# EAGLE schematic miner (EAGLE 6.4)
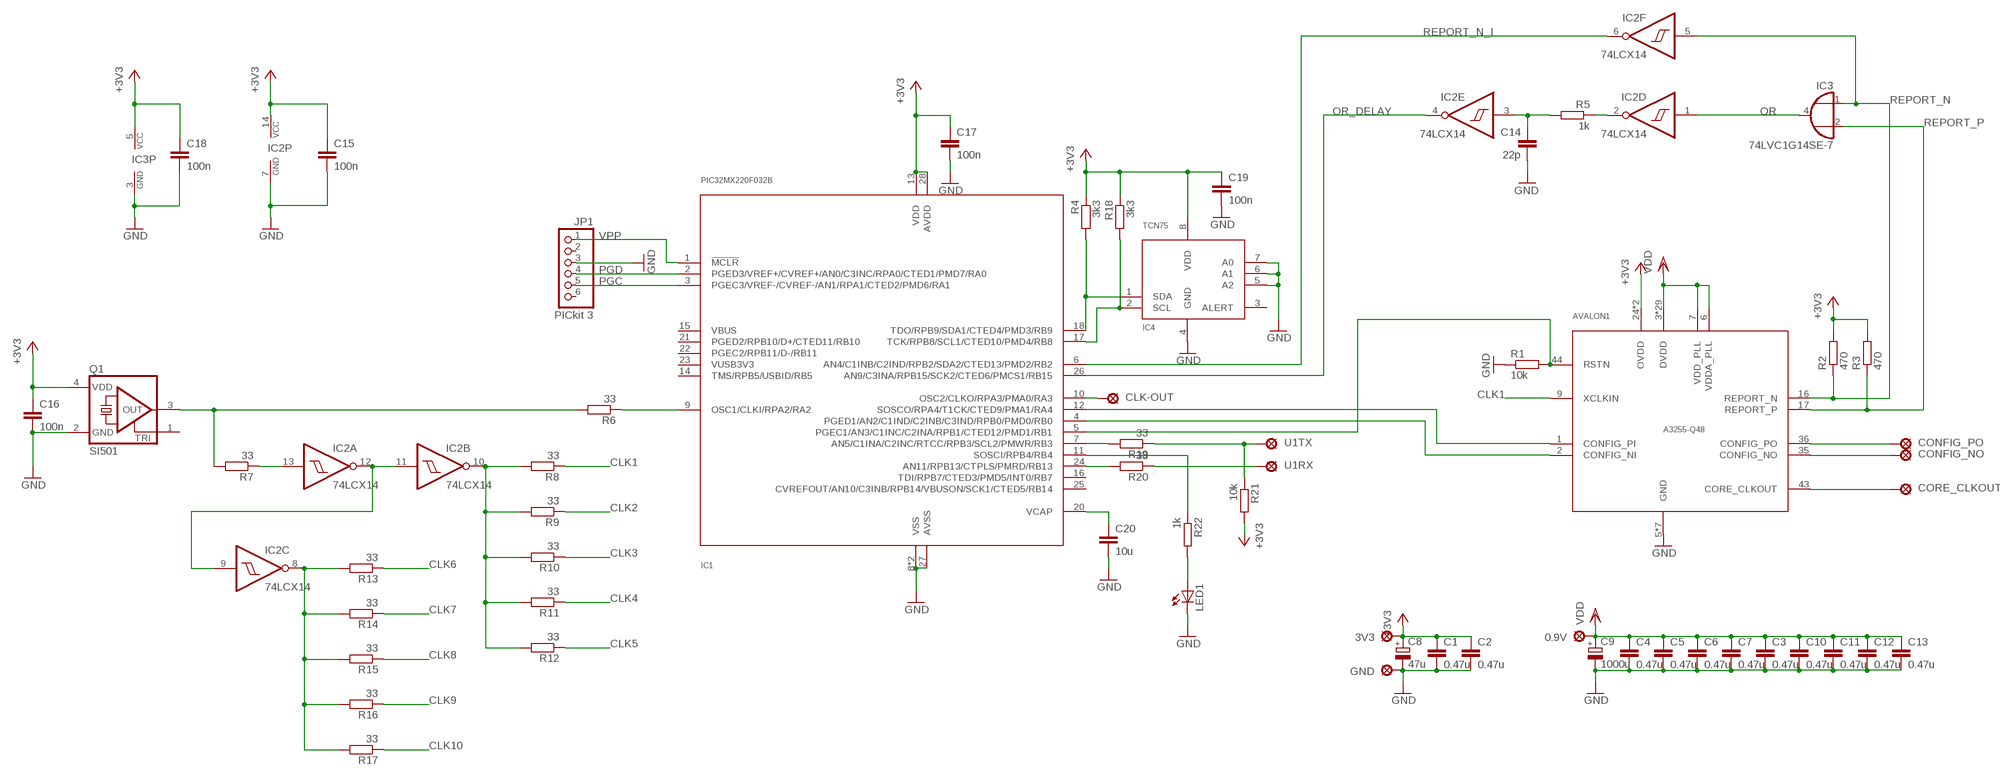
[diagram p0: schematic, sheet 1]

## Parts
0.9V  LSP10  [LSP10]
3V3  LSP10  [LSP10]
AVALON1  A3255-Q48  [QFN48]
C1  0.47u  C-EUC0805  [C0805]
C2  0.47u  C-EUC0805  [C0805]
C3  0.47u  C-EUC0805  [C0805]
C4  0.47u  C-EUC0805  [C0805]
C5  0.47u  C-EUC0805  [C0805]
C6  0.47u  C-EUC0805  [C0805]
C7  0.47u  C-EUC0805  [C0805]
C8  47u  CPOL-EU150CLZ-1010  [150CLZ-1010]
C9  1000u  CPOL-EU150CLZ-1010  [150CLZ-1010]
C10  0.47u  C-EUC0805  [C0805]
C11  0.47u  C-EUC0805  [C0805]
C12  0.47u  C-EUC0805  [C0805]
C13  0.47u  C-EUC0805  [C0805]
C14  22p  C-EUC0805  [C0805]
C15  100n  C-EUC0805  [C0805]
C16  100n  C-EUC0805  [C0805]
C17  100n  C-EUC0805  [C0805]
C18  100n  C-EUC0805  [C0805]
C19  100n  C-EUC0805  [C0805]
C20  10u  C-EUC0805  [C0805]
CLK-OUT  LSP10  [LSP10]
CONFIG_NO  LSP10  [LSP10]
CONFIG_PO  LSP10  [LSP10]
CORE_CLKOUT  LSP10  [LSP10]
GND  LSP10  [LSP10]
IC1  PIC32MX220F032B  [SSOP28]
IC2  74LCX14  74LS14D  [SO14]
IC3  74LVC1G14SE-7  74AHC1G32DCK  [SC70-5]
IC4  TCN75  [SOIC8]
JP1  PICkit 3  PINHD-1X6  [1X06]
LED1  LED5MM  [LED5MM]
Q1  SI501  [DFN4]
R1  10k  R-EU_R0805  [R0805]
R2  470  R-EU_R0805  [R0805]
R3  470  R-EU_R0805  [R0805]
R4  3k3  R-EU_R0805  [R0805]
R5  1k  R-EU_R0805  [R0805]
R6  33  R-EU_R0805  [R0805]
R7  33  R-EU_R0805  [R0805]
R8  33  R-EU_R0805  [R0805]
R9  33  R-EU_R0805  [R0805]
R10  33  R-EU_R0805  [R0805]
R11  33  R-EU_R0805  [R0805]
R12  33  R-EU_R0805  [R0805]
R13  33  R-EU_R0805  [R0805]
R14  33  R-EU_R0805  [R0805]
R15  33  R-EU_R0805  [R0805]
R16  33  R-EU_R0805  [R0805]
R17  33  R-EU_R0805  [R0805]
R18  3k3  R-EU_R0805  [R0805]
R19  33  R-EU_R0805  [R0805]
R20  33  R-EU_R0805  [R0805]
R21  10k  R-EU_R0805  [R0805]
R22  1k  R-EU_R0805  [R0805]
U1RX  LSP10  [LSP10]
U1TX  LSP10  [LSP10]

## Nets
+3V3: 3V3.MP AVALON1.24(OVDD) AVALON1.37(OVDD) C1.1 C2.1 C8.+ C15.1 C16.1 C17.1 C18.1 C19.1 IC1.13(VDD) IC1.28(AVDD) IC2.14(P:VCC) IC3.5(VCC) IC4.8(VDD) Q1.4(VDD) R2.2 R3.2 R4.1 R18.1 R21.2
CLK1: AVALON1.9(XCLKIN) R8.1
CLK2: R9.1
CLK3: R10.1
CLK4: R11.1
CLK5: R12.1
CLK6: R13.1
CLK7: R14.1
CLK8: R15.1
CLK9: R16.1
CLK10: R17.1
GND: AVALON1.5(GND) AVALON1.8(GND) AVALON1.12(GND) AVALON1.23(GND) AVALON1.27(GND) AVALON1.38(GND) AVALON1.EP-PAD(GND) C1.2 C2.2 C3.2 C4.2 C5.2 C6.2 C7.2 C8.- C9.- C10.2 C11.2 C12.2 C13.2 C14.2 C15.2 C16.2 C17.2 C18.2 C19.2 C20.2 GND.MP IC1.8(VSS) IC1.19(VSS) IC1.27(AVSS) IC2.7(P:GND) IC3.3(GND) IC4.4(GND) IC4.5(A2) IC4.6(A1) IC4.7(A0) JP1.3 LED1.K(C) Q1.2(GND) R1.1
N$1: AVALON1.44(RSTN) IC1.5(PGEC1/AN3/C1INC/C2INA/RPB1/CTED12/PMD1/RB1) R1.2
N$2: IC1.18(TDO/RPB9/SDA1/CTED4/PMD3/RB9) IC4.1(SDA) R4.2
N$3: IC1.17(TCK/RPB8/SCL1/CTED10/PMD4/RB8) IC4.2(SCL) R18.2
N$4: IC1.7(AN5/C1INA/C2INC/RTCC/RPB3/SCL2/PMWR/RB3) R19.2
N$5: IC1.24(AN11/RPB13/CTPLS/PMRD/RB13) R20.2
N$6: AVALON1.1(CONFIG_PI) IC1.12(SOSCO/RPA4/T1CK/CTED9/PMA1/RA4)
N$7: AVALON1.2(CONFIG_NI) IC1.4(PGED1/AN2/C1IND/C2INB/C3IND/RPB0/PMD0/RB0)
N$8: AVALON1.36(CONFIG_PO) CONFIG_PO.MP
N$9: AVALON1.35(CONFIG_NO) CONFIG_NO.MP
N$10: AVALON1.43(CORE_CLKOUT) CORE_CLKOUT.MP
N$11: Q1.3(OUT) R6.2 R7.2
N$12: IC2.13(A:I) R7.1
N$13: IC2.2(D:O) R5.1
N$14: C14.1 IC2.3(E:I) R5.2
N$15: IC2.9(C:I) IC2.11(B:I) IC2.12(A:O)
N$16: IC2.10(B:O) R8.2 R9.2 R10.2 R11.2 R12.2
N$17: IC2.8(C:O) R13.2 R14.2 R15.2 R16.2 R17.2
N$18: IC1.9(OSC1/CLKI/RPA2/RA2) R6.1
N$19: C20.1 IC1.20(VCAP)
N$20: R19.1 R21.1 U1TX.MP
N$21: CLK-OUT.MP IC1.10(OSC2/CLKO/RPA3/PMA0/RA3)
N$22: IC1.11(SOSCI/RPB4/RB4) R22.1
N$23: R20.1 U1RX.MP
N$24: LED1.A R22.2
OR: IC2.1(D:I) IC3.4(O)
OR_DELAY: IC1.26(AN9/C3INA/RPB15/SCK2/CTED6/PMCS1/RB15) IC2.4(E:O)
PGC: IC1.3(PGEC3/VREF-/CVREF-/AN1/RPA1/CTED2/PMD6/RA1) JP1.5
PGD: IC1.2(PGED3/VREF+/CVREF+/AN0/C3INC/RPA0/CTED1/PMD7/RA0) JP1.4
REPORT_N: AVALON1.16(REPORT_N) IC2.5(F:I) IC3.1(I0) R2.1
REPORT_N_I: IC1.6(AN4/C1INB/C2IND/RPB2/SDA2/CTED13/PMD2/RB2) IC2.6(F:O)
REPORT_P: AVALON1.17(REPORT_P) IC3.2(I1) R3.1
VDD: 0.9V.MP AVALON1.3(DVDD) AVALON1.4(DVDD) AVALON1.6(VDDA_PLL) AVALON1.7(VDD_PLL) AVALON1.10(DVDD) AVALON1.11(DVDD) AVALON1.13(DVDD) AVALON1.14(DVDD) AVALON1.15(DVDD) AVALON1.18(DVDD) AVALON1.19(DVDD) AVALON1.20(DVDD) AVALON1.21(DVDD) AVALON1.22(DVDD) AVALON1.25(DVDD) AVALON1.26(DVDD) AVALON1.28(DVDD) AVALON1.29(DVDD) AVALON1.30(DVDD) AVALON1.31(DVDD) AVALON1.32(DVDD) AVALON1.33(DVDD) AVALON1.34(DVDD) AVALON1.39(DVDD) AVALON1.40(DVDD) AVALON1.41(DVDD) AVALON1.42(DVDD) AVALON1.45(DVDD) AVALON1.46(DVDD) AVALON1.47(DVDD) AVALON1.48(DVDD) C3.1 C4.1 C5.1 C6.1 C7.1 C9.+ C10.1 C11.1 C12.1 C13.1
VPP: IC1.1(!MCLR) JP1.1
Unconnected: IC1.14(TMS/RPB5/USBID/RB5) IC1.15(VBUS) IC1.16(TDI/RPB7/CTED3/PMD5/INT0/RB7) IC1.21(PGED2/RPB10/D+/CTED11/RB10) IC1.22(PGEC2/RPB11/D-/RB11) IC1.23(VUSB3V3) IC1.25(CVREFOUT/AN10/C3INB/RPB14/VBUSON/SCK1/CTED5/RB14) IC4.3(ALERT) JP1.2 JP1.6 Q1.1(TRI)

## Library data of the parts
0.9V 3V3 CLK-OUT CONFIG_NO CONFIG_PO CORE_CLKOUT GND U1RX U1TX = solpad:LSP10: SOLDER PAD drill 1.0 mm, distributor Buerklin, 12H555
AVALON1 = avalon:A3255-Q48
C1-C7 C10-C20 = rcl:C-EU: CAPACITOR, European symbol
C8 C9 = rcl:CPOL-EU: POLARIZED CAPACITOR, European symbol
IC1 = miner:PIC32MX220F032B
IC2 = 74xx-eu:74*14: Hex schmitt trigger INVERTER
IC3 = 74xx-little-de:74*1G32: 2-input OR gate
IC4 = miner:TCN75
JP1 = pinhead:PINHD-1X6: PIN HEADER
LED1 = led:LED: LED OSRAM: - CHIPLED LG R971, LG N971, LY N971, LG Q971, LY Q971, LO R971, LY R971 LH N974, LH R974 LS Q976, LO Q976, LY Q976 LO Q996 - Hyper CHIPLED LW Q18S LB Q993, LB Q99A, LB R99A - SideLED LS A670, LO A670, LY A670, LG A670, LP A670 LB A673, LV A673, LT A673, LW A673 LH A674 LY A675 LS A676, LA A676, LO A676, LY A676, LW A676 LS A679, LY A679, LG A679 - Hyper Micro SIDELED® LS Y876, LA Y876, LO Y876, LY Y876 LT Y87S - SmartLED LW L88C, LW L88S LB L89C, LB L89S, LG L890 LS L89K, LO L89K, LY L89K LS L896, LA L896, LO L896, LY L896 - TOPLED LS T670, LO T670, LY T670, LG T670, LP T670 LSG T670, LSP T670, LSY T670, LOP T670, LYG T670 LG T671, LOG T671, LSG T671 LB T673, LV T673, LT T673, LW T673 LH T674 LS T676, LA T676, LO T676, LY T676, LB T676, LH T676, LSB T676, LW T676 LB T67C, LV T67C, LT T67C, LS T67K, LO T67K, LY T67K, LW E67C LS E67B, LA E67B, LO E67B, LY E67B, LB E67C, LV E67C, LT E67C LW T67C LS T679, LY T679, LG T679 LS T770, LO T770, LY T770, LG T770, LP T770 LB T773, LV T773, LT T773, LW T773 LH T774 LS E675, LA E675, LY E675, LS T675 LS T776, LA T776, LO T776, LY T776, LB T776 LHGB T686 LT T68C, LB T68C - Hyper Mini TOPLED® LB M676 - Mini TOPLED Santana® LG M470 LS M47K, LO M47K, LY M47K Source: http://www.osram.convergy.de LUXEON: - LUMILED® LXK2-PW12-R00, LXK2-PW12-S00, LXK2-PW14-U00, LXK2-PW14-V00 LXK2-PM12-R00, LXK2-PM12-S00, LXK2-PM14-U00 LXK2-PE12-Q00, LXK2-PE12-R00, LXK2-PE12-S00, LXK2-PE14-T00, LXK2-PE14-U00 LXK2-PB12-K00, LXK2-PB12-L00, LXK2-PB12-M00, LXK2-PB14-N00, LXK2-PB14-P00, LXK2-PB14-Q00 LXK2-PR12-L00, LXK2-PR12-M00, LXK2-PR14-Q00, LXK2-PR14-R00 LXK2-PD12-Q00, LXK2-PD12-R00, LXK2-PD12-S00 LXK2-PH12-R00, LXK2-PH12-S00 LXK2-PL12-P00, LXK2-PL12-Q00, LXK2-PL12-R00 Source: www.luxeon.com KINGBRIGHT: KA-3528ASYC Source: www.kingbright.com
Q1 = miner:SI501: 3.3Vdc CMOS SMD CRYSTAL CLOCK OSCILLATOR SOurce: www.abracon.com; OC_FARNELL: unknown; OC_NEWARK: unknown
R1-R22 = rcl:R-EU_: RESISTOR, European symbol